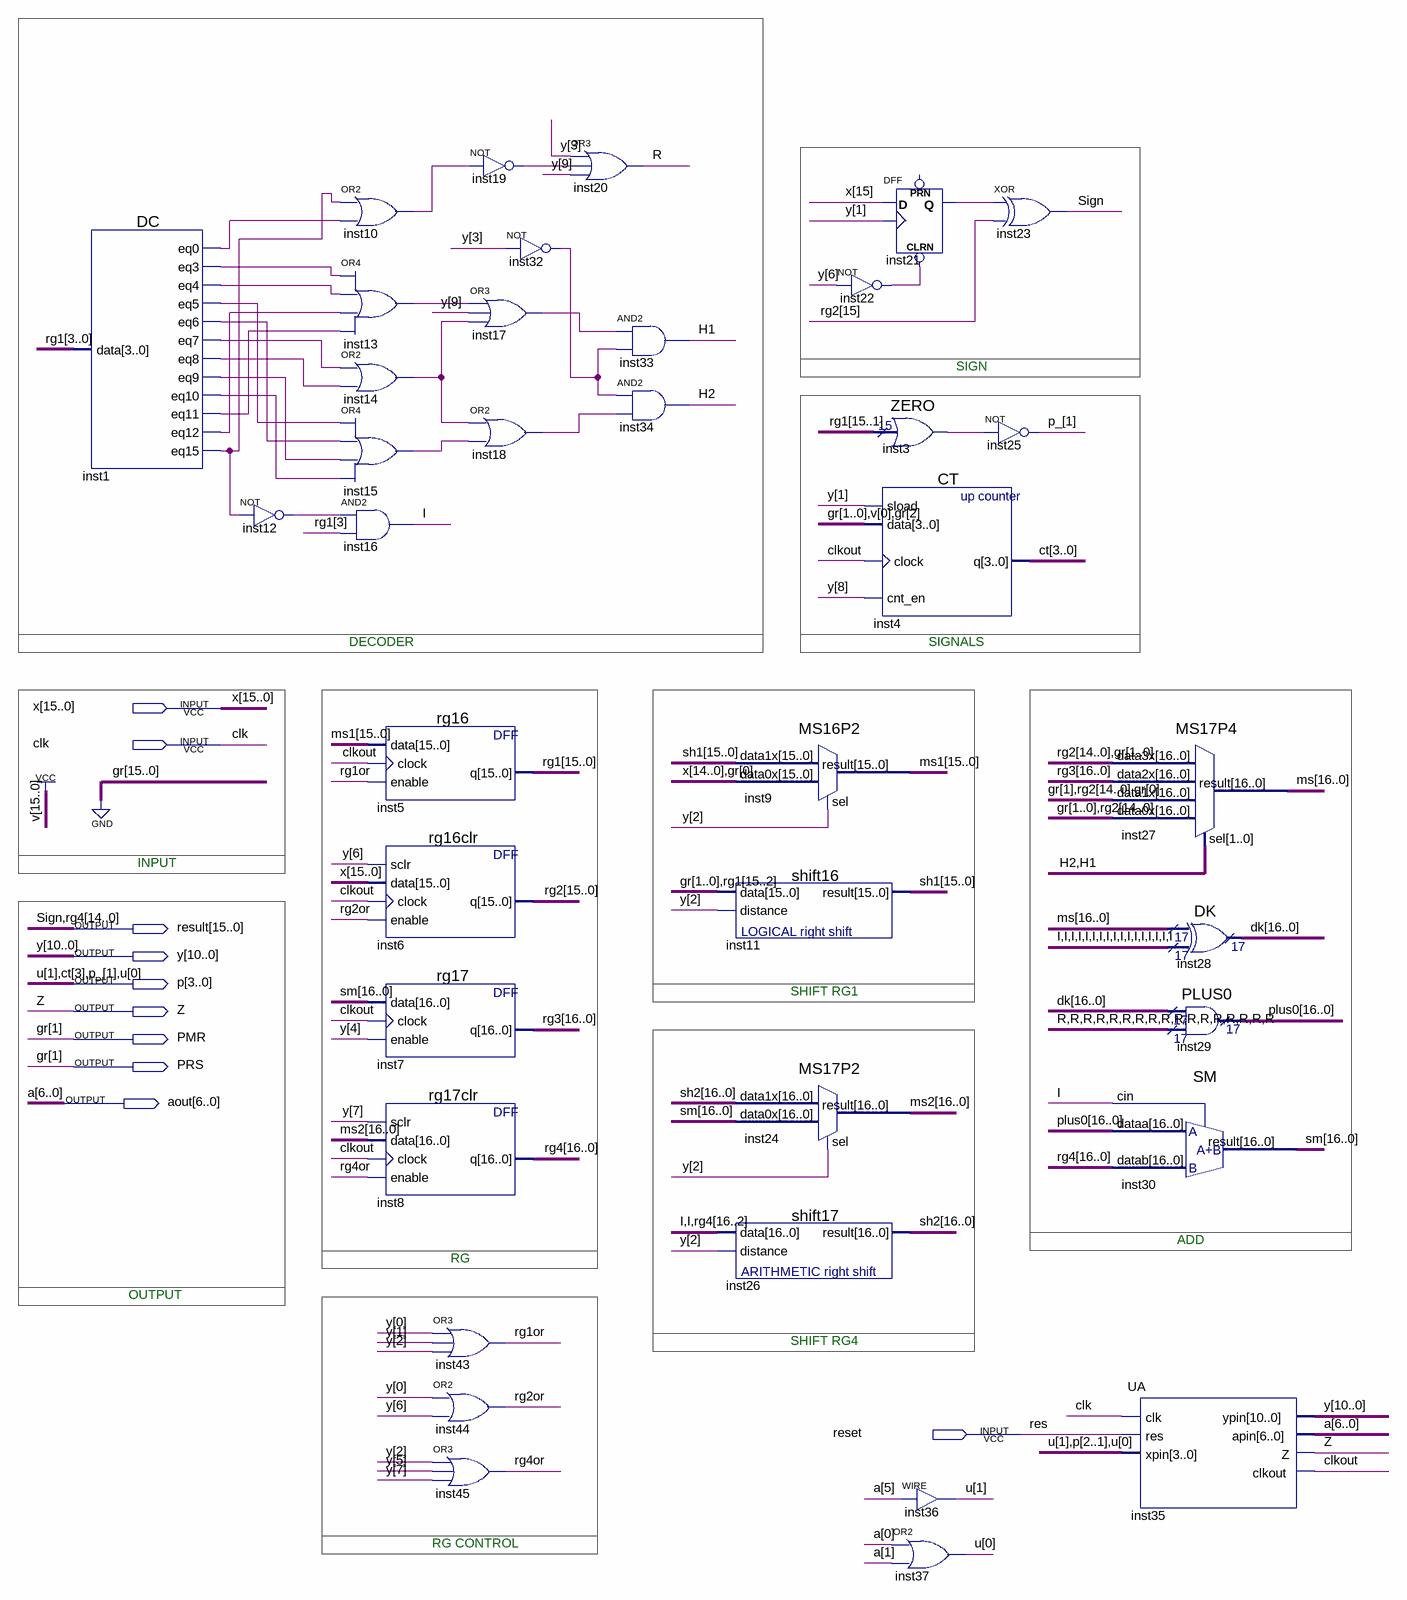
[diagram p0: schematic sheet]
// Quartus schematic OA.bdf as structural Verilog: 38 symbols, 10 pins
module OA (
  input  [15:0] x,
  input  clk,
  input  reset,
  output [15:0] result,
  output [10:0] y,
  output [3:0] p,
  output Z,
  output PMR,
  output PRS,
  output [6:0] aout
);

  wire clkout, H1, H2, I, inst1_eq0, inst1_eq3, inst1_eq4, inst1_eq5, inst1_eq6, inst1_eq7, inst1_eq8,
       inst1_eq9, inst1_eq10, inst1_eq11, inst1_eq12, inst1_eq15, inst3_result, inst10_out, inst12_out,
       inst13_out, inst14_out, inst15_out, inst17_out, inst18_out, inst19_out, inst21_q, inst22_out,
       inst32_out, R, rg1or, rg2or, rg4or;
  wire [2:0] ct;
  wire [15:0] ms1, rg1, rg2, sh1;
  wire [16:0] dk, ms, ms2, plus0, rg3, sh2, sm;
  wire [16:15] rg4;

  DC inst1 (
    .data(rg1[3:0]), .eq0(inst1_eq0), .eq3(inst1_eq3), .eq4(inst1_eq4), .eq5(inst1_eq5), .eq6(inst1_eq6),
    .eq7(inst1_eq7), .eq8(inst1_eq8), .eq9(inst1_eq9), .eq10(inst1_eq10), .eq11(inst1_eq11),
    .eq12(inst1_eq12), .eq15(inst1_eq15));
  not inst12 (inst12_out, inst1_eq15);
  or inst10 (inst10_out, inst1_eq15, inst1_eq0);
  or inst13 (inst13_out, inst1_eq3, inst1_eq4, inst1_eq12, inst1_eq11);
  or inst14 (inst14_out, inst1_eq7, inst1_eq8);
  or inst15 (inst15_out, inst1_eq5, inst1_eq6, inst1_eq9, inst1_eq10);
  and inst16 (I, inst12_out, rg1[3]);
  rg16 inst5 (.data(ms1), .clock(clkout), .enable(rg1or), .q(rg1));
  rg16clr inst6 (.sclr(y[6]), .data(x), .clock(clkout), .enable(rg2or), .q(rg2));
  rg17 inst7 (.data(sm), .clock(clkout), .enable(y[4]), .q(rg3));
  rg17clr inst8 (.sclr(y[7]), .data(ms2), .clock(clkout), .enable(rg4or), .q({rg4, result[14:0]}));
  not inst19 (inst19_out, inst10_out);
  or inst17 (inst17_out, inst13_out, y[9], inst14_out);
  or inst18 (inst18_out, inst14_out, inst15_out);
  or inst43 (rg1or, y[0], y[1], y[2]);
  or inst44 (rg2or, y[0], y[6]);
  or inst45 (rg4or, y[2], y[5], y[7]);
  or inst20 (R, y[3], inst19_out, y[9]);
  not inst32 (inst32_out, y[3]);
  and inst33 (H1, inst17_out, inst32_out);
  and inst34 (H2, inst32_out, inst18_out);
  shift16 inst11 (.data({2'b00, rg1[15:2]}), .distance(y[2]), .result(sh1));
  shift17 inst26 (.data({{2{I}}, rg4, result[14:2]}), .distance(y[2]), .result(sh2));
  MS16P2 inst9 (.data1x(sh1), .data0x({x[14:0], 1'b0}), .sel(y[2]), .result(ms1));
  MS17P2 inst24 (.data1x(sh2), .data0x(sm), .sel(y[2]), .result(ms2));
  not inst22 (inst22_out, y[6]);
  CT inst4 (.sload(y[1]), .data(4'b0010), .clock(clkout), .cnt_en(y[8]), .q({p[2], ct}));
  DFF inst21 (.CLRN(inst22_out), .CLK(y[1]), .D(x[15]), .Q(inst21_q));  // open: PRN
  ZERO inst3 (.data(rg1[15:1]), .result(inst3_result));
  assign p[3] = aout[5];  // WIRE inst36
  or inst37 (p[0], aout[0], aout[1]);
  xor inst23 (result[15], inst21_q, rg2[15]);
  not inst25 (p[1], inst3_result);
  MS17P4 inst27 (
    .data3x({rg2[14:0], 2'b00}), .data2x(rg3), .data1x({1'b0, rg2[14:0], 1'b0}), .data0x({2'b00, rg2[14:0]}),
    .sel({H2, H1}), .result(ms));
  SM inst30 (.dataa(plus0), .datab({rg4, result[14:0]}), .cin(I), .result(sm));
  UA inst35 (.clk(clk), .res(reset), .xpin(p), .ypin(y), .apin(aout), .Z(Z), .clkout(clkout));
  DK inst28 (.data0x(ms), .data1x({17{I}}), .result(dk));
  PLUS0 inst29 (.data0x(dk), .data1x({17{R}}), .result(plus0));

  assign PMR = 1'b0;
  assign PRS = 1'b0;

  // Other names for the same wires on the sheet: a[6:0] = aout; ct[3] = p[2]; p_[1] = p[1]; res = reset;
  //   rg4[14:0] = result[14:0]; Sign = result[15]; u[1:0] = {p[3], p[0]}

  // Notes on the sheet:
  //   SIGN
  //   DECODER
  //   SIGNALS
  //   INPUT
  //   SHIFT RG1
  //   ADD
  //   RG
  //   OUTPUT
  //   SHIFT RG4
  //   RG CONTROL
endmodule
